# Altium schematic sheet Arduino and PMOD Connectors.SchDoc: Low Speed Expansion
size Tabloid; Date: 7/17/2014; ApprovedBy: NA; CompanyName: Cospan Design LLC; DocumentNumber: 14; SheetNumber: 14; SheetTotal: 20; Client: Public; Project: Enigma; ProjectPrettyName: Enigma; ProjectName: Enigma
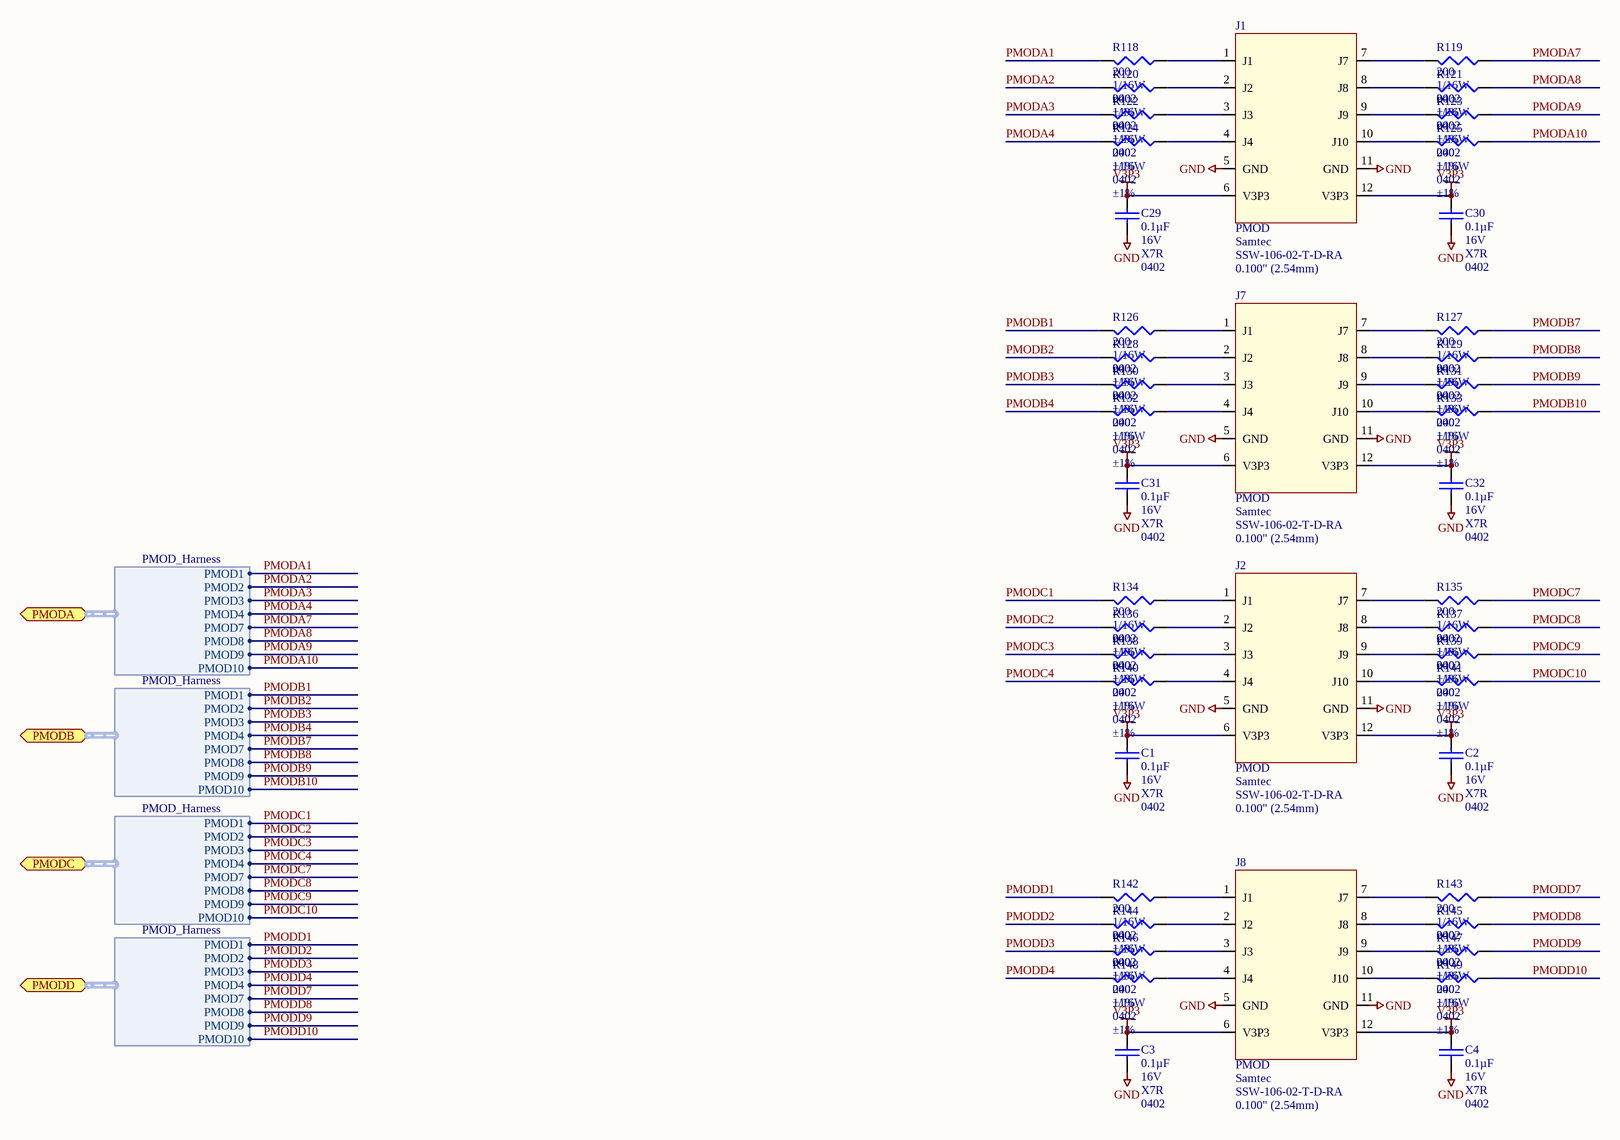
[diagram p0: Arduino and PMOD Connectors.SchDoc]

## Parts
C1  Capacitance: 0.1µF  Voltage - Rated: 16V  Temperature Coefficient: X7R  Package / Case: 0402  [C_0402]  (hidden comment: 0.1uF)
C2  Capacitance: 0.1µF  Voltage - Rated: 16V  Temperature Coefficient: X7R  Package / Case: 0402  [C_0402]  (hidden comment: 0.1uF)
C3  Capacitance: 0.1µF  Voltage - Rated: 16V  Temperature Coefficient: X7R  Package / Case: 0402  [C_0402]  (hidden comment: 0.1uF)
C4  Capacitance: 0.1µF  Voltage - Rated: 16V  Temperature Coefficient: X7R  Package / Case: 0402  [C_0402]  (hidden comment: 0.1uF)
C29  Capacitance: 0.1µF  Voltage - Rated: 16V  Temperature Coefficient: X7R  Package / Case: 0402  [C_0402]  (hidden comment: 0.1uF)
C30  Capacitance: 0.1µF  Voltage - Rated: 16V  Temperature Coefficient: X7R  Package / Case: 0402  [C_0402]  (hidden comment: 0.1uF)
C31  Capacitance: 0.1µF  Voltage - Rated: 16V  Temperature Coefficient: X7R  Package / Case: 0402  [C_0402]  (hidden comment: 0.1uF)
C32  Capacitance: 0.1µF  Voltage - Rated: 16V  Temperature Coefficient: X7R  Package / Case: 0402  [C_0402]  (hidden comment: 0.1uF)
J1  PMOD  Manufacturer: Samtec  Manufacturer Part Number: SSW-106-02-T-D-RA  Pitch: 0.100" (2.54mm)  [PMOD]
J2  PMOD  Manufacturer: Samtec  Manufacturer Part Number: SSW-106-02-T-D-RA  Pitch: 0.100" (2.54mm)  [PMOD]
J7  PMOD  Manufacturer: Samtec  Manufacturer Part Number: SSW-106-02-T-D-RA  Pitch: 0.100" (2.54mm)  [PMOD]
J8  PMOD  Manufacturer: Samtec  Manufacturer Part Number: SSW-106-02-T-D-RA  Pitch: 0.100" (2.54mm)  [PMOD]
R118  Resistance In Ohms: 200  Power (Watts): 1/16W  Case: 0402  Tolerance: ±1%  [R_0402]  (hidden comment: R_0402_200)
R119  Resistance In Ohms: 200  Power (Watts): 1/16W  Case: 0402  Tolerance: ±1%  [R_0402]  (hidden comment: R_0402_200)
R120  Resistance In Ohms: 200  Power (Watts): 1/16W  Case: 0402  Tolerance: ±1%  [R_0402]  (hidden comment: R_0402_200)
R121  Resistance In Ohms: 200  Power (Watts): 1/16W  Case: 0402  Tolerance: ±1%  [R_0402]  (hidden comment: R_0402_200)
R122  Resistance In Ohms: 200  Power (Watts): 1/16W  Case: 0402  Tolerance: ±1%  [R_0402]  (hidden comment: R_0402_200)
R123  Resistance In Ohms: 200  Power (Watts): 1/16W  Case: 0402  Tolerance: ±1%  [R_0402]  (hidden comment: R_0402_200)
R124  Resistance In Ohms: 200  Power (Watts): 1/16W  Case: 0402  Tolerance: ±1%  [R_0402]  (hidden comment: R_0402_200)
R125  Resistance In Ohms: 200  Power (Watts): 1/16W  Case: 0402  Tolerance: ±1%  [R_0402]  (hidden comment: R_0402_200)
R126  Resistance In Ohms: 200  Power (Watts): 1/16W  Case: 0402  Tolerance: ±1%  [R_0402]  (hidden comment: R_0402_200)
R127  Resistance In Ohms: 200  Power (Watts): 1/16W  Case: 0402  Tolerance: ±1%  [R_0402]  (hidden comment: R_0402_200)
R128  Resistance In Ohms: 200  Power (Watts): 1/16W  Case: 0402  Tolerance: ±1%  [R_0402]  (hidden comment: R_0402_200)
R129  Resistance In Ohms: 200  Power (Watts): 1/16W  Case: 0402  Tolerance: ±1%  [R_0402]  (hidden comment: R_0402_200)
R130  Resistance In Ohms: 200  Power (Watts): 1/16W  Case: 0402  Tolerance: ±1%  [R_0402]  (hidden comment: R_0402_200)
R131  Resistance In Ohms: 200  Power (Watts): 1/16W  Case: 0402  Tolerance: ±1%  [R_0402]  (hidden comment: R_0402_200)
R132  Resistance In Ohms: 200  Power (Watts): 1/16W  Case: 0402  Tolerance: ±1%  [R_0402]  (hidden comment: R_0402_200)
R133  Resistance In Ohms: 200  Power (Watts): 1/16W  Case: 0402  Tolerance: ±1%  [R_0402]  (hidden comment: R_0402_200)
R134  Resistance In Ohms: 200  Power (Watts): 1/16W  Case: 0402  Tolerance: ±1%  [R_0402]  (hidden comment: R_0402_200)
R135  Resistance In Ohms: 200  Power (Watts): 1/16W  Case: 0402  Tolerance: ±1%  [R_0402]  (hidden comment: R_0402_200)
R136  Resistance In Ohms: 200  Power (Watts): 1/16W  Case: 0402  Tolerance: ±1%  [R_0402]  (hidden comment: R_0402_200)
R137  Resistance In Ohms: 200  Power (Watts): 1/16W  Case: 0402  Tolerance: ±1%  [R_0402]  (hidden comment: R_0402_200)
R138  Resistance In Ohms: 200  Power (Watts): 1/16W  Case: 0402  Tolerance: ±1%  [R_0402]  (hidden comment: R_0402_200)
R139  Resistance In Ohms: 200  Power (Watts): 1/16W  Case: 0402  Tolerance: ±1%  [R_0402]  (hidden comment: R_0402_200)
R140  Resistance In Ohms: 200  Power (Watts): 1/16W  Case: 0402  Tolerance: ±1%  [R_0402]  (hidden comment: R_0402_200)
R141  Resistance In Ohms: 200  Power (Watts): 1/16W  Case: 0402  Tolerance: ±1%  [R_0402]  (hidden comment: R_0402_200)
R142  Resistance In Ohms: 200  Power (Watts): 1/16W  Case: 0402  Tolerance: ±1%  [R_0402]  (hidden comment: R_0402_200)
R143  Resistance In Ohms: 200  Power (Watts): 1/16W  Case: 0402  Tolerance: ±1%  [R_0402]  (hidden comment: R_0402_200)
R144  Resistance In Ohms: 200  Power (Watts): 1/16W  Case: 0402  Tolerance: ±1%  [R_0402]  (hidden comment: R_0402_200)
R145  Resistance In Ohms: 200  Power (Watts): 1/16W  Case: 0402  Tolerance: ±1%  [R_0402]  (hidden comment: R_0402_200)
R146  Resistance In Ohms: 200  Power (Watts): 1/16W  Case: 0402  Tolerance: ±1%  [R_0402]  (hidden comment: R_0402_200)
R147  Resistance In Ohms: 200  Power (Watts): 1/16W  Case: 0402  Tolerance: ±1%  [R_0402]  (hidden comment: R_0402_200)
R148  Resistance In Ohms: 200  Power (Watts): 1/16W  Case: 0402  Tolerance: ±1%  [R_0402]  (hidden comment: R_0402_200)
R149  Resistance In Ohms: 200  Power (Watts): 1/16W  Case: 0402  Tolerance: ±1%  [R_0402]  (hidden comment: R_0402_200)

## Ports
PMODA (harness PMOD_Harness), PMODB (harness PMOD_Harness), PMODC (harness PMOD_Harness), PMODD (harness PMOD_Harness)

## Harnesses
PMOD_Harness: PMOD1, PMOD2, PMOD3, PMOD4, PMOD7, PMOD8, PMOD9, PMOD10

## Nets
GND: C1.1 C2.1 C3.1 C4.1 C29.1 C30.1 C31.1 C32.1 J1.5(GND) J1.11(GND) J2.5(GND) J2.11(GND) J7.5(GND) J7.11(GND) J8.5(GND) J8.11(GND)
V3P3: C1.2 C2.2 C3.2 C4.2 C29.2 C30.2 C31.2 C32.2 J1.6(V3P3) J1.12(V3P3) J2.6(V3P3) J2.12(V3P3) J7.6(V3P3) J7.12(V3P3) J8.6(V3P3) J8.12(V3P3)
PMODA1: R118.1 ; port PMODA.PMOD1
PMODA2: R120.1 ; port PMODA.PMOD2
PMODA3: R122.1 ; port PMODA.PMOD3
PMODA4: R124.1 ; port PMODA.PMOD4
PMODA7: R119.2 ; port PMODA.PMOD7
PMODA8: R121.2 ; port PMODA.PMOD8
PMODA9: R123.2 ; port PMODA.PMOD9
PMODA10: R125.2 ; port PMODA.PMOD10
PMODB1: R126.1 ; port PMODB.PMOD1
PMODB2: R128.1 ; port PMODB.PMOD2
PMODB3: R130.1 ; port PMODB.PMOD3
PMODB4: R132.1 ; port PMODB.PMOD4
PMODB7: R127.2 ; port PMODB.PMOD7
PMODB8: R129.2 ; port PMODB.PMOD8
PMODB9: R131.2 ; port PMODB.PMOD9
PMODB10: R133.2 ; port PMODB.PMOD10
PMODC1: R134.1 ; port PMODC.PMOD1
PMODC2: R136.1 ; port PMODC.PMOD2
PMODC3: R138.1 ; port PMODC.PMOD3
PMODC4: R140.1 ; port PMODC.PMOD4
PMODC7: R135.2 ; port PMODC.PMOD7
PMODC8: R137.2 ; port PMODC.PMOD8
PMODC9: R139.2 ; port PMODC.PMOD9
PMODC10: R141.2 ; port PMODC.PMOD10
PMODD1: R142.1 ; port PMODD.PMOD1
PMODD2: R144.1 ; port PMODD.PMOD2
PMODD3: R146.1 ; port PMODD.PMOD3
PMODD4: R148.1 ; port PMODD.PMOD4
PMODD7: R143.2 ; port PMODD.PMOD7
PMODD8: R145.2 ; port PMODD.PMOD8
PMODD9: R147.2 ; port PMODD.PMOD9
PMODD10: R149.2 ; port PMODD.PMOD10
NetJ1_1: J1.1(J1) R118.2
NetJ1_2: J1.2(J2) R120.2
NetJ1_3: J1.3(J3) R122.2
NetJ1_4: J1.4(J4) R124.2
NetJ1_7: J1.7(J7) R119.1
NetJ1_8: J1.8(J8) R121.1
NetJ1_9: J1.9(J9) R123.1
NetJ1_10: J1.10(J10) R125.1
NetJ2_1: J2.1(J1) R134.2
NetJ2_2: J2.2(J2) R136.2
NetJ2_3: J2.3(J3) R138.2
NetJ2_4: J2.4(J4) R140.2
NetJ2_7: J2.7(J7) R135.1
NetJ2_8: J2.8(J8) R137.1
NetJ2_9: J2.9(J9) R139.1
NetJ2_10: J2.10(J10) R141.1
NetJ7_1: J7.1(J1) R126.2
NetJ7_2: J7.2(J2) R128.2
NetJ7_3: J7.3(J3) R130.2
NetJ7_4: J7.4(J4) R132.2
NetJ7_7: J7.7(J7) R127.1
NetJ7_8: J7.8(J8) R129.1
NetJ7_9: J7.9(J9) R131.1
NetJ7_10: J7.10(J10) R133.1
NetJ8_1: J8.1(J1) R142.2
NetJ8_2: J8.2(J2) R144.2
NetJ8_3: J8.3(J3) R146.2
NetJ8_4: J8.4(J4) R148.2
NetJ8_7: J8.7(J7) R143.1
NetJ8_8: J8.8(J8) R145.1
NetJ8_9: J8.9(J9) R147.1
NetJ8_10: J8.10(J10) R149.1

## Notes on the sheet
- Title:
- http://www.cospandesign.com
- Cospan Design
- Project:
- Document:
- Engineer:
- Revision:
- Drawn By:
- Date:
- Number:
- of

## Library data of the parts
C1-C4 C29-C32 = C_0402_0.1UF_16V: CAP CER .10UF 16V X7R 0402; Manufacturer: Murata Electronics North America; Manufacturer Part Number: GRM155R71C104KA88J; Tolerance: ±10%; Description: CAP CER 0.1UF 16V X7R 0402; Supplier 1: Digi-Key; Supplier Part Number 1: 490-6328-1-ND; RoHS: RoHS Compliant; Category: Capacitors; Stock 1: 18103134; Mounting Type: Surface Mount, MLCC; Features: -; Lead Spacing: -; Packaging: Cut Tape (CT); ComponentLink1URL: http://www.murata.com/~/media/webrenewal/support/library/catalog/products/capacitor/mlcc/c02e.ashx?la=en-us; ComponentLink1Description: http://www.murata.com/~/media/webrenewal/support/library/catalog/products/capacitor/mlcc/c02e.ashx?la=en-us; Operating Temperature: -55°C ~ 125°C; Pricing 1: 1=0.1, 10=0.014, 100=0.0062, 500=0.00442, 1000=0.00348, 2500=0.00316, 5000=0.00291 (USD); Part Status: Active; Ratings: -; Applications: General Purpose; Size / Dimension: 0.039" L x 0.020" W (1.00mm x 0.50mm); Height - Seated (Max): -; Thickness (Max): 0.022" (0.55mm)
J1 J2 J7 J8 = J_PMOD: CONN FEMALE 12POS DL .1" R/A TIN; Connector Type: Header; Number of Positions: 12; Number of Positions Loaded: All; Supplier 1: Samtec; Supplier Part Number 1: SSW-106-02-T-D-RA; Category: Connectors, Interconnects; Stock 1: 890; Contact Type: Female Socket; Number of Rows: 2; Row Spacing: 0.100" (2.54mm); Mounting Type: Through Hole, Right Angle; Termination: Solder; Fastening Type: -; Features: -; Contact Finish: Tin; Contact Finish Thickness: -; Color: Black; ComponentLink1URL: http://www.sullinscorp.com/drawings/101_xPxCxx2LJBN-RC,_10494-C.pdf; ComponentLink1Description: http://www.sullinscorp.com/drawings/101_xPxCxx2LJBN-RC,_10494-C.pdf; Pricing: 1=0.723
R118-R149 = R_0402_200: RES 200 OHM 1/10W 1% 0402 SMD; Manufacturer: Panasonic Electronic Components; Manufacturer Part Number: ERJ-2RKF2000X; Temperature Coefficient: ±100ppm/°C; Description: RES SMD 200 OHM 1% 1/10W 0402; Supplier 1: Digi-Key; RoHS: RoHS Compliant; Category: Resistors; Stock 1: 1082421; Pricing 1: 1=0.1, 10=0.028, 100=0.0113, 1000=0.00509, 2500=0.00442, 5000=0.00365 (USD); Composition: Thick Film; Features: Automotive AEC-Q200; Package / Case: 0402 (1005 Metric); Supplier Device Package: 0402; Size / Dimension: 0.039" L x 0.020" W (1.00mm x 0.50mm); Packaging: Cut Tape (CT); ComponentLink1URL: https://industrial.panasonic.com/cdbs/www-data/pdf/RDA0000/AOA0000C304.pdf; ComponentLink1Description: https://industrial.panasonic.com/cdbs/www-data/pdf/RDA0000/AOA0000C304.pdf; Supplier Part Number 1: P200LCT-ND; Part Status: Active; Operating Temperature: -55°C ~ 155°C; Height - Seated (Max): 0.016" (0.40mm); Failure Rate: -